# EAGLE design Ultrafin(43)v6_fin (EAGLE 7.4.0)
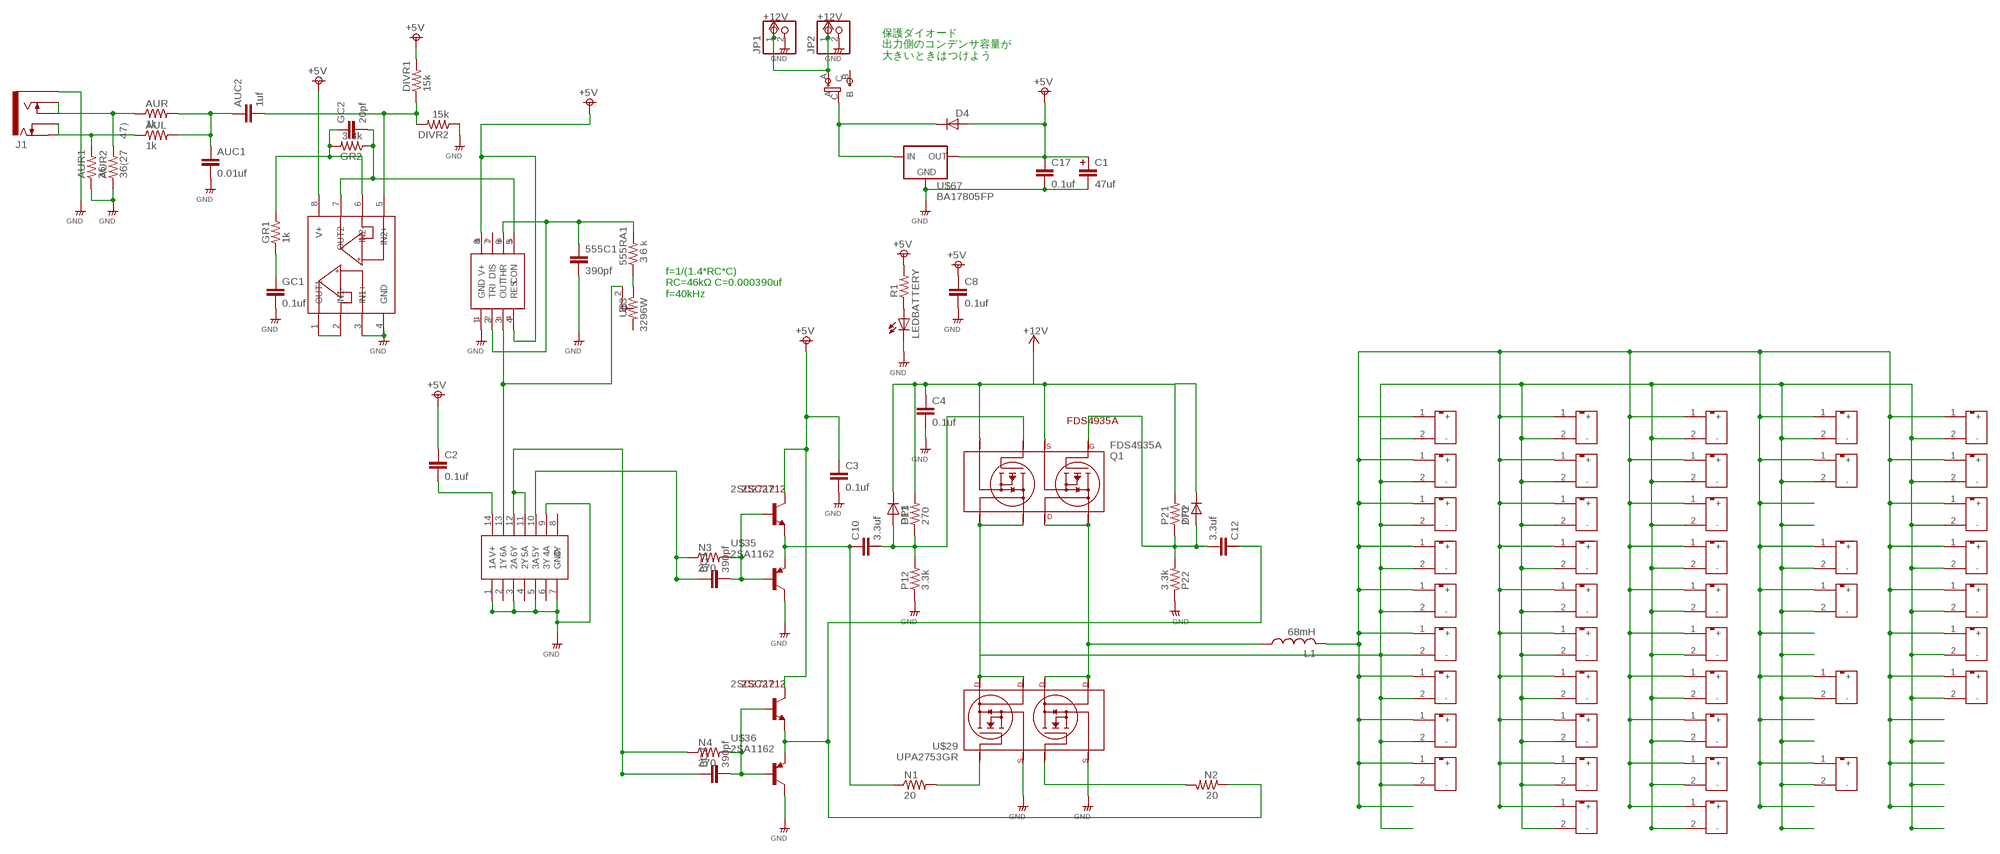
[diagram p0: schematic, sheet 1]

## Parts
555C1  390pf  MLCC  [1608]
555RA1  ３6ｋ  RESISTORS-3  [R_0.3]
AUC1  0.01uf  MLCC  [1608]
AUC2  1uf  MLCC  [1608]
AUL  1k  RESISTORS  [3225]
AUR  1k  RESISTORS  [3225]
AUR1  36  RESISTORS-3  [R_0.3]
AUR2  36(27 47)  RESISTORS1608  [1608]
BC1  390pf  MLCC-3  [MLCC_50]
BC2  390pf  MLCC  [1608]
C1  47uf  CAPACITOR-1U  [C_1U]
C2  0.1uf  MLCC  [1608]
C3  0.1uf  MLCC  [1608]
C4  0.1uf  MLCC  [1608]
C8  0.1uf  MLCC  [1608]
C10  3.3uf  MLCC-3  [MLCC_50]
C12  3.3uf  MLCC-3  [MLCC_50]
C17  0.1uf  MLCC  [1608]
D4  DIODE_JISSO2  [DIODE_JISSO2]
DIVR1  15k  RESISTORS-3  [R_0.3]
DIVR2  15k  RESISTORS-3  [R_0.3]
DP1  DIODE_3  [DIODE_3]
DP2  DIODE_3  [DIODE_3]
GC1  0.1uf  MLCC  [1608]
GC2  20pf  MLCC  [1608]
GR1  1k  RESISTORS  [3225]
GR2  3.3k  RESISTORS-3  [R_0.3]
J1  MJ-352W-C  [MJ-352-M-C]
JP1  PINHD-1X2"  [1*02]
JP2  PINHD-1X2"  [1*02]
L1  68mH  LHL10NB104J  [LHL10NB104J]
LEDBATTERY  LED3MM  [LED3MM]
N1  20  RESISTORS1608  [1608]
N2  20  RESISTORS-3  [R_0.3]
N3  270  RESISTORS1608  [1608]
N4  270  RESISTORS1608  [1608]
P11  270  RESISTORS-3  [R_0.3]
P12  3.3k  RESISTORS-3  [R_0.3]
P21  270  RESISTORS-3  [R_0.3]
P22  3.3k  RESISTORS-3  [R_0.3]
Q1  FDS4935A  [FDS4935A]
R1  RESISTORS3216  [3216]
U$3  3296W  [R_VARIABLE]
U$4  UT1007-Z325R  [UT1007-Z325R]
U$5  ICM7555CD  [SOP8]
U$8  UT1007-Z325R  [UT1007-Z325R]
U$10  UT1007-Z325R  [UT1007-Z325R]
U$11  UT1007-Z325R  [UT1007-Z325R]
U$12  UT1007-Z325R  [UT1007-Z325R]
U$14  74HC04NS  [SOP14]
U$16  BF2904F  [SOP8]
U$18  UT1007-Z325R  [UT1007-Z325R]
U$23  UT1007-Z325R  [UT1007-Z325R]
U$25  UT1007-Z325R  [UT1007-Z325R]
U$27  UT1007-Z325R  [UT1007-Z325R]
U$28  UT1007-Z325R  [UT1007-Z325R]
U$29  UPA2753GR  [UPA2753GR]
U$31  UT1007-Z325R  [UT1007-Z325R]
U$35  2SA1162  [2SA1162]
U$36  2SA1162  [2SA1162]
U$37  2SC2712  [2SC2712]
U$38  2SC2712  [2SC2712]
U$39  UT1007-Z325R  [UT1007-Z325R]
U$40  UT1007-Z325R  [UT1007-Z325R]
U$42  UT1007-Z325R  [UT1007-Z325R]
U$45  UT1007-Z325R  [UT1007-Z325R]
U$46  UT1007-Z325R  [UT1007-Z325R]
U$47  UT1007-Z325R  [UT1007-Z325R]
U$48  UT1007-Z325R  [UT1007-Z325R]
U$49  UT1007-Z325R  [UT1007-Z325R]
U$50  UT1007-Z325R  [UT1007-Z325R]
U$51  UT1007-Z325R  [UT1007-Z325R]
U$52  UT1007-Z325R  [UT1007-Z325R]
U$53  UT1007-Z325R  [UT1007-Z325R]
U$54  UT1007-Z325R  [UT1007-Z325R]
U$55  UT1007-Z325R  [UT1007-Z325R]
U$56  UT1007-Z325R  [UT1007-Z325R]
U$57  UT1007-Z325R  [UT1007-Z325R]
U$58  UT1007-Z325R  [UT1007-Z325R]
U$59  UT1007-Z325R  [UT1007-Z325R]
U$60  UT1007-Z325R  [UT1007-Z325R]
U$61  UT1007-Z325R  [UT1007-Z325R]
U$62  UT1007-Z325R  [UT1007-Z325R]
U$63  UT1007-Z325R  [UT1007-Z325R]
U$64  UT1007-Z325R  [UT1007-Z325R]
U$67  BA17805FP  [BA17805FP]
U$71  UT1007-Z325R  [UT1007-Z325R]
U$74  UT1007-Z325R  [UT1007-Z325R]
U$78  UT1007-Z325R  [UT1007-Z325R]
U$79  UT1007-Z325R  [UT1007-Z325R]
U$80  UT1007-Z325R  [UT1007-Z325R]
U$81  UT1007-Z325R  [UT1007-Z325R]
U$82  UT1007-Z325R  [UT1007-Z325R]
U$83  UT1007-Z325R  [UT1007-Z325R]
U$84  SLIDE_ESD175202  [SLIDE_ESD175202]

## Nets
+5V: C1.P$1 C2.P$1 C3.P$1 C8.P$1 C17.P$1 D4.P$1(A) DIVR1.2 R1.P$6 U$5.4(RES) U$5.8(V+) U$16.8(V+) U$37.C U$38.C U$67.OUTPUT(OUT)
+12V: C4.P$1 DP1.C DP2.C JP1.1 JP2.1 P11.2 P21.2 Q1.1(S2) Q1.3(S1) U$84.A
AGND: 555C1.P$2 AUC1.P$2 AUR1.1 AUR2.P$1 C1.P$2 C8.P$2 C17.P$2 DIVR2.1 GC1.P$2 J1.1 JP1.2 JP2.2 LEDBATTERY.K(C) P12.1 P22.1 U$5.1(GND) U$14.1(1A) U$14.3(2A) U$14.5(3A) U$14.7(GND) U$14.9(4A) U$16.3(IN1+) U$16.4(GND) U$29.1(S1) U$29.3(S2) U$35.C U$36.C U$67.COMMON(GND) ; supply symbol labelled GND
GND: C3.P$2 C4.P$2
N$1: AUR2.P$2 AUR.P$1 J1.2 J1.3
N$2: AUL.P$1 AUR1.2 J1.4 J1.5
N$3: AUC1.P$1 AUC2.P$1 AUL.P$2 AUR.P$2
N$4: C12.1 N2.1 U$36.E U$38.E
N$5: BC2.P$1 N4.P$1 U$14.11(5A) U$14.12(6Y)
N$6: Q1.7(D22) Q1.8(D21) U$4.2(-) U$8.2(-) U$10.2(-) U$11.2(-) U$12.2(-) U$18.2(-) U$23.2(-) U$25.2(-) U$27.2(-) U$28.2(-) U$29.7(D12) U$29.8(D11) U$31.2(-) U$39.2(-) U$40.2(-) U$42.2(-) U$45.2(-) U$46.2(-) U$47.2(-) U$48.2(-) U$49.2(-) U$50.2(-) U$51.2(-) U$52.2(-) U$53.2(-) U$54.2(-) U$55.2(-) U$56.2(-) U$57.2(-) U$58.2(-) U$59.2(-) U$60.2(-) U$61.2(-) U$62.2(-) U$63.2(-) U$64.2(-) U$71.2(-) U$74.2(-) U$78.2(-) U$79.2(-) U$80.2(-) U$81.2(-) U$82.2(-) U$83.2(-)
N$7: 555C1.P$1 555RA1.2 U$5.2(TRI) U$5.6(THR)
N$8: U$3.2 U$5.3(OUT) U$14.13(6A)
N$9: 555RA1.1 U$3.1
N$10: L1.1 Q1.5(D12) Q1.6(D11) U$29.5(D22) U$29.6(D21)
N$11: C10.1 N1.P$1 U$35.E U$37.E
N$12: C10.2 DP1.A P11.1 P12.2 Q1.2(G2)
N$16: BC1.2 N3.P$2 U$35.B U$37.B
N$18: BC2.P$2 N4.P$2 U$36.B U$38.B
N$20: BC1.1 N3.P$1 U$14.10(5Y)
N$21: N1.P$2 U$29.2(G1)
N$22: AUC2.P$2 DIVR1.1 DIVR2.2 U$16.5(IN2+)
N$24: GC2.P$1 GR1.P$2 GR2.2 U$16.6(IN2-)
N$25: GC1.P$1 GR1.P$1
N$26: C12.2 DP2.A P21.1 P22.2 Q1.4(G1)
N$28: N2.2 U$29.4(G2)
N$29: D4.P$2(C) U$67.INPUT(IN) U$84.C
N$30: U$16.1(OUT1) U$16.2(IN1-)
N$39: GC2.P$2 GR2.1 U$5.5(CON) U$16.7(OUT2)
N$40: LEDBATTERY.A R1.P$5
N$41: L1.2 U$4.1(+) U$8.1(+) U$10.1(+) U$11.1(+) U$12.1(+) U$18.1(+) U$23.1(+) U$25.1(+) U$27.1(+) U$28.1(+) U$31.1(+) U$39.1(+) U$40.1(+) U$42.1(+) U$45.1(+) U$46.1(+) U$47.1(+) U$48.1(+) U$49.1(+) U$50.1(+) U$51.1(+) U$52.1(+) U$53.1(+) U$54.1(+) U$55.1(+) U$56.1(+) U$57.1(+) U$58.1(+) U$59.1(+) U$60.1(+) U$61.1(+) U$62.1(+) U$63.1(+) U$64.1(+) U$71.1(+) U$74.1(+) U$78.1(+) U$79.1(+) U$80.1(+) U$81.1(+) U$82.1(+) U$83.1(+)
N$43: C2.P$2 U$14.14(V+)
Unconnected: U$3.3 U$5.7(DIS) U$14.2(1Y) U$14.4(2Y) U$14.6(3Y) U$14.8(4Y) U$84.B

## Notes on the sheet
- 保護ダイオード
  出力側のコンデンサ容量が
  大きいときはつけよう
- f=1/(1.4*RC*C)
  RC=46kΩ C=0.000390uf
  f=40kHz

## Library data of the parts
555C1 AUC1 AUC2 BC1 BC2 C2-C4 C8 C10 C12 C17 GC1 GC2 = rcl__s:MLCC: CAPACITOR, European symbol
555RA1 AUL AUR AUR1 AUR2 DIVR1 DIVR2 GR1 GR2 N1-N4 P11 P12 P21 P22 R1 = rcl__s:RESISTORS
C1 = rcl__s:CAPACITOR
D4 DP1 DP2 = diode_s:DIODE
J1 = demi:MJ-352W-C: MJ-352W-C Marushin 3.5mm Stereo Jack
JP1 JP2 = pinhead_s:PINHD-1X2: PIN HEADER
L1 = Coil:LHL10NB104J
LEDBATTERY = LED_s:LED: LED OSRAM: - CHIPLED LG R971, LG N971, LY N971, LG Q971, LY Q971, LO R971, LY R971 LH N974, LH R974 LS Q976, LO Q976, LY Q976 LO Q996 - Hyper CHIPLED LW Q18S LB Q993, LB Q99A, LB R99A - SideLED LS A670, LO A670, LY A670, LG A670, LP A670 LB A673, LV A673, LT A673, LW A673 LH A674 LY A675 LS A676, LA A676, LO A676, LY A676, LW A676 LS A679, LY A679, LG A679 - Hyper Micro SIDELED® LS Y876, LA Y876, LO Y876, LY Y876 LT Y87S - SmartLED LW L88C, LW L88S LB L89C, LB L89S, LG L890 LS L89K, LO L89K, LY L89K LS L896, LA L896, LO L896, LY L896 - TOPLED LS T670, LO T670, LY T670, LG T670, LP T670 LSG T670, LSP T670, LSY T670, LOP T670, LYG T670 LG T671, LOG T671, LSG T671 LB T673, LV T673, LT T673, LW T673 LH T674 LS T676, LA T676, LO T676, LY T676, LB T676, LH T676, LSB T676, LW T676 LB T67C, LV T67C, LT T67C, LS T67K, LO T67K, LY T67K, LW E67C LS E67B, LA E67B, LO E67B, LY E67B, LB E67C, LV E67C, LT E67C LW T67C LS T679, LY T679, LG T679 LS T770, LO T770, LY T770, LG T770, LP T770 LB T773, LV T773, LT T773, LW T773 LH T774 LS E675, LA E675, LY E675, LS T675 LS T776, LA T776, LO T776, LY T776, LB T776 LHGB T686 LT T68C, LB T68C - Hyper Mini TOPLED® LB M676 - Mini TOPLED Santana® LG M470 LS M47K, LO M47K, LY M47K Source: http://www.osram.convergy.de - LUMILED® LXK2-PW12-R00, LXK2-PW12-S00, LXK2-PW14-U00, LXK2-PW14-V00 LXK2-PM12-R00, LXK2-PM12-S00, LXK2-PM14-U00 LXK2-PE12-Q00, LXK2-PE12-R00, LXK2-PE12-S00, LXK2-PE14-T00, LXK2-PE14-U00 LXK2-PB12-K00, LXK2-PB12-L00, LXK2-PB12-M00, LXK2-PB14-N00, LXK2-PB14-P00, LXK2-PB14-Q00 LXK2-PR12-L00, LXK2-PR12-M00, LXK2-PR14-Q00, LXK2-PR14-R00 LXK2-PD12-Q00, LXK2-PD12-R00, LXK2-PD12-S00 LXK2-PH12-R00, LXK2-PH12-S00 LXK2-PL12-P00, LXK2-PL12-Q00, LXK2-PL12-R00 Source: www.luxeon.com
Q1 = FET_s:FDS4935A
U$3 = rcl__s:3296W
U$4 U$8 U$10-U$12 U$18 U$23 U$25 U$27 U$28 U$31 U$39 U$40 U$42 U$45-U$64 U$71 U$74 U$78-U$83 = UT1007-Z325R:UT1007-Z325R
U$5 = LMC555:ICM7555CD
U$14 = 74HCserias:74HC04NS
U$16 = OP_s:BF2904F
U$29 = FET_s:UPA2753GR
U$35 U$36 = demi:2SA1162
U$37 U$38 = demi:2SC2712
U$67 = regulator_s:BA17805FP
U$84 = switch_s:SLIDE_ESD175202

## Board
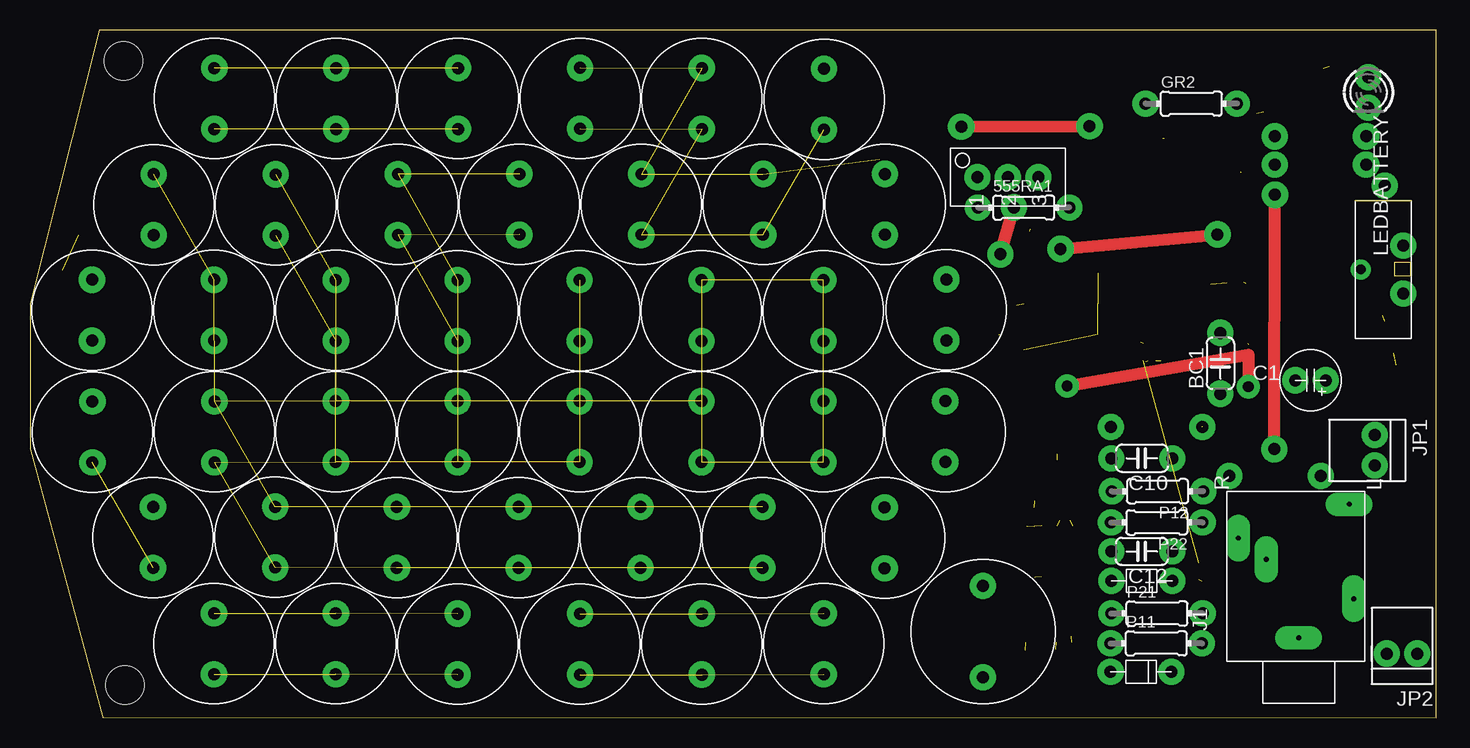
[diagram p1: board, top side]
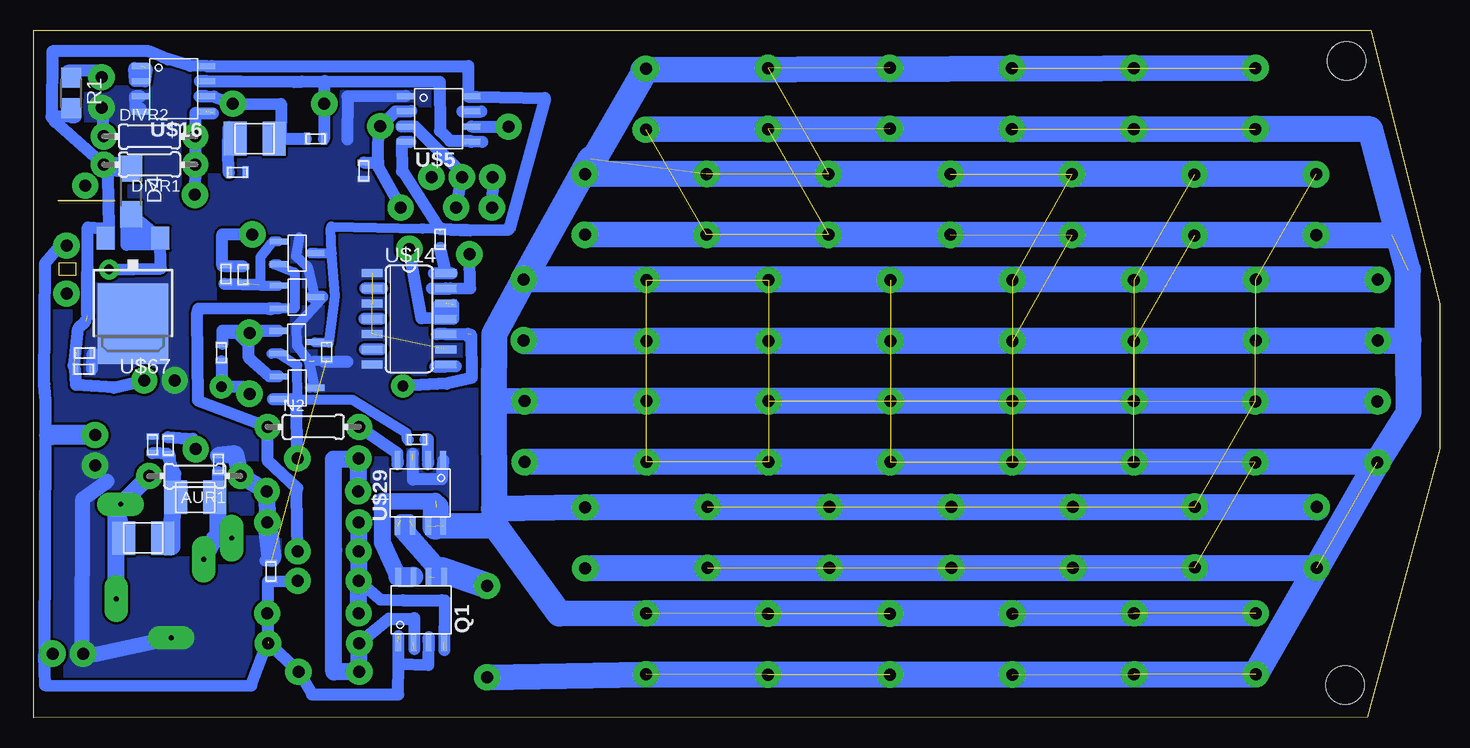
[diagram p2: board, bottom side, seen from below]

Size 117.24 x 57.36 mm. Coordinates in mm from the lower left corner, seen from the top.
Outline: 117.24,57.33 5.76,57.36 0,34.53 0.02,22.42 6.06,0.05 117.24,0 117.24,57.33
Copper layers (1*16): Top 0.035mm / dielectric 1.5mm / Bottom 0.035mm
Design rules "default": minimum track width 10mil, minimum drill 24mil, track to track 8mil, track to pad 8mil, pad to pad 8mil, via to via 8mil, smd to smd 8mil, copper to edge 40mil, drill to drill 8mil, minimum pad ring 10mil, minimum via ring 8mil, stop-mask expansion 4mil, vias tented up to drill 0mil, thermal gap 10mil
Holes 3.2 mm at 7.78,54.79 7.91,2.75

### Footprints (pad centres in the part's own frame; a part is rotated, then mirrored left to right if it is on the bottom)
1608 = smd 0.5 x 1: P$1 -0.7,0; P$2 0.7,0
R_0.3 = drill 1 pad 2.184: 1 -3.81,0; 2 3.81,0; 3 -3.81,0
3225 = smd 1.9 x 2.8: P$1 -1.27,0.02; P$2 1.98,0.02
MLCC_50 = drill 1 pad 2.184: 1 -2.54,0; 2 2.54,0
C_1U = drill 1 pad 2.184: P$1 -1.27,0; P$2 1.27,0
DIODE_JISSO2 = smd 2.184 x 1.829: P$1 -1.905,0; P$2 1.905,0
DIODE_3 = drill 1 pad 2.184: A -2.54,0; C 2.54,0
MJ-352-M-C = drill 0.4 pad 1.95 long: 1 -4.655,-1.99; 2 3.645,3.05; 3 1.875,0.72; 4 6.475,-6.2; 5 -1.405,-6.58
1*02 = drill 1 pad 2.184: 1 -1.27,0; 2 1.27,0
LHL10NB104J = drill 1 pad 2.184: 1 0,3.81; 2 0,-3.81
LED3MM = drill 1 pad 2.184: A -1.27,0; K 1.27,0
FDS4935A = smd 1.5 x 0.5: 1 -2.74,1.905; 2 -2.74,0.635; 3 -2.74,-0.635; 4 -2.74,-1.905; 5 2.74,-1.905; 6 2.74,-0.635; 7 2.74,0.635; 8 2.74,1.905
3216 = smd 1.676 x 1.676: P$5 0,0; P$6 2.54,0
R_VARIABLE = drill 1 pad 2.184: 1 0.019,-2.578; 2 0.019,-0.037; 3 0.019,2.502
UT1007-Z325R = drill 1 pad 2.184: 1 0,2.54; 2 0,-2.54
SOP8 = smd 1.5 x 0.5: 1 -2.74,1.905; 2 -2.74,0.635; 3 -2.74,-0.635; 4 -2.74,-1.905; 5 2.74,-1.905; 6 2.74,-0.635; 7 2.74,0.635; 8 2.74,1.905
SOP14 = smd 0.66 x 1.778: 1 -3.81,-3.073; 2 -2.54,-3.073; 3 -1.27,-3.073; 4 0,-3.073; 5 1.27,-3.073; 6 2.54,-3.073; 7 3.81,-3.073; 8 3.81,3.073; 9 2.54,3.073; 10 1.27,3.073; 11 0,3.073; 12 -1.27,3.073; 13 -2.54,3.073; 14 -3.81,3.073
UPA2753GR = smd 1.5 x 0.5: 1 -2.74,1.905; 2 -2.74,0.635; 3 -2.74,-0.635; 4 -2.74,-1.905; 5 2.74,-1.905; 6 2.74,-0.635; 7 2.74,0.635; 8 2.74,1.905
2SA1162 = smd 1.524 x 0.508: B -1.459,0.767; C 1.594,-0.182; E -1.459,-1.133
2SC2712 = smd 1.524 x 0.508: B -1.696,0.95; C 1.356,0; E -1.696,-0.95
BA17805FP = smd 5.908 x 6.708: COMMON 0,1.547 | smd 1.508 x 1.93: INPUT -2.28,-5.594; OUTPUT 2.28,-5.594
SLIDE_ESD175202 = drill 1 pad 2.184: A -0.031,-7.735; B -0.031,-3.735; S2 1.531,-12.735 | drill 0.8 pad 1.676: C 3.519,-5.747

### Placement (x,y rotation side)
555C1  89.71,45.61 270 bottom
555RA1  82.84,42.55 0 top
AUC1  107.31,22.78 90 bottom
AUC2  106.01,22.7 90 bottom
AUL  108.46,14.97 0 bottom
AUR  103.41,18.42 180 bottom
AUR1  103.79,20.16 180 bottom
AUR2  101.84,21.16 270 bottom
BC1  99.23,29.56 90 top
BC2  99.77,36.94 270 bottom
C1  106.74,28.15 180 top
C2  83.34,39.9 270 bottom
C3  92.81,30.5 270 bottom
C4  97.44,12.21 90 bottom
C8  113.06,29.07 0 bottom
C10  92.69,21.64 180 top
C12  92.68,13.88 180 top
C17  113,30.42 0 bottom
D4  109.09,43.9 270 bottom
DIVR1  107.57,46.14 180 bottom
DIVR2  107.57,48.49 0 bottom
DP1  92.61,3.83 0 top
DP2  92.68,11.43 0 top
GC1  100.23,45.49 0 bottom
GC2  93.73,48.28 0 bottom
GR1  99.16,48.28 0 bottom
GR2  96.81,51.22 0 top
J1  103.77,11.34 90 top
JP1  112.11,22.31 270 top
JP2  114.38,5.35 180 top
L1  79.44,7.19 0 top
LEDBATTERY  111.57,52.15 270 top
N1  85.26,23.21 0 bottom
N2  93.92,24.26 0 bottom
N3  101.57,30.44 90 bottom
N4  101.19,37.01 270 bottom
P11  93.88,6.21 0 top
P12  94,18.89 180 top
P21  93.95,8.7 0 top
P22  93.93,16.29 180 top
Q1  84.93,9.02 90 bottom
R1  114.09,53.38 270 bottom
U$3  81.57,45.1 270 top
U$4  25.5,23.86 180 top
U$5  83.47,49.95 0 bottom
U$8  15.34,6.18 180 top
U$10  25.5,6.18 180 top
U$11  35.66,6.15 180 top
U$12  45.85,6.15 180 top
U$14  85.93,33.26 270 bottom
U$16  105.57,52.45 0 bottom
U$18  56.01,6.15 180 top
U$23  66.17,6.18 180 top
U$25  30.58,15.04 180 top
U$27  25.5,33.98 180 top
U$28  30.67,42.8 180 top
U$29  84.99,18.75 270 bottom
U$31  45.86,51.66 180 top
U$35  95.35,27.71 0 bottom
U$36  95.35,35.28 0 bottom
U$37  95.12,31.32 0 bottom
U$38  95.11,38.77 0 bottom
U$39  20.43,15.07 180 top
U$40  56.01,51.64 180 top
U$42  71.25,15.01 180 top
U$45  20.48,42.77 180 top
U$46  35.69,51.64 180 top
U$47  25.53,51.64 180 top
U$48  15.37,51.64 180 top
U$49  15.34,33.99 180 top
U$50  40.8,42.82 180 top
U$51  50.96,42.82 180 top
U$52  61.12,42.82 180 top
U$53  71.28,42.82 180 top
U$54  76.39,34.02 180 top
U$55  55.98,23.86 180 top
U$56  45.82,23.86 180 top
U$57  35.66,23.86 180 top
U$58  66.14,33.96 180 top
U$59  76.3,23.86 180 top
U$60  66.14,23.86 180 top
U$61  55.98,33.96 180 top
U$62  45.82,33.96 180 top
U$63  35.66,33.96 180 top
U$64  40.74,15.04 180 top
U$67  108.95,34.4 180 bottom
U$71  15.38,23.85 180 top
U$74  66.2,51.58 180 top
U$78  50.9,15.04 180 top
U$79  61.06,15.04 180 top
U$80  10.26,15.04 180 top
U$81  5.18,33.99 180 top
U$82  10.32,42.79 180 top
U$83  5.21,23.83 180 top
U$84  114.46,31.64 180 top

### Tracks (layer width: path | path; a pad name or v marks a point on that pad's centre or on a via)
+5V  (4 unrouted)
  Bottom 0.813: U$37.C 92.61,31.29 92.11,35.17 92.38,38.73 | U$38.C 94.11,38.77 94.11,38.75 92.38,38.73 | 92.38,38.73 93.52,38.72 92.39,38.78 92.49,40.75 92.42,40.85 92.42,40.98 84.87,40.82 84.84,40.81 84.73,40.81 83.71,40.84
  Bottom 1.016: 112.74,33.55 112.71,40.91 110.93,40.79 | 83.71,40.84 81.04,40.65 | 81.04,40.65 82.19,40.68 77.6,40.72 74.61,51.68 80.28,51.79 81.02,51.81 | U$5.8 81.02,51.81 | 81.02,51.81 80.99,54.34 102.36,54.34 U$16.8 104.14,54.38 106.43,55.07 | 106.43,55.07 106.04,54.91 | U$5.4 85.82,48.01 86.2,48.02 86.55,48.02 86.55,47.99 86.52,45.56 86.49,45.58 83.38,40.77 80.8,40.65 81.04,40.65 | 106.43,55.07 107.6,55.58 115.67,55.58 115.73,50.18 | 111.36,46.2 DIVR1.2 | 115.73,50.18 115.76,50.09 115.44,49.71 DIVR1.2 | R1.P$6 114.14,50.09 113.73,50.09 115.73,50.18 | 112.9,33.1 113.51,32.5 113.86,29.35 113.89,29.42 113.86,29.26 C8.P$1 113.7,27.77 110.52,27.55 C1.P$1 | U$67.OUTPUT 110.93,40 110.93,40.79 | 110.93,40.79 111.03,45.2 DIVR1.2 | 111.09,45.99 DIVR1.2
  Bottom 1.676: D4.P$1 111.09,45.99
+12V  (3 unrouted)
  Bottom 1.016: 114.49,39.26 U$84.A 115.03,39.38 116.29,37.87 116.3,37.87 116.27,37.83 116.33,27.86 | 86.82,4.47 86.84,1.96 94.01,1.96 DP1.C 97.66,6.34 97.66,6.37 97.82,6.11 99.09,2.72 99.09,2.69 116.27,2.72 116.36,5.23 | 86.82,4.47 86.8,6.81 | Q1.3 84.3,6.75 84.33,4.4 86.82,4.47 | 116.28,23.59 116.27,26.75 116.33,27.86 | 116.28,23.59 116.36,5.23 | DP2.C 97.69,11.37 P11.2 97.69,8.21 97.76,8.27 P21.2 | 116.3,27.23 116.33,27.86 | 116.36,5.23 JP2.1 | JP1.1 116.28,23.59
AGND  (6 unrouted)
  Bottom 0.813: 94.2,27.55 U$35.C 94.27,29.77 95.28,31.04 95.31,32.69 93.22,34.98 U$36.C 94.36,37.58 95.34,38.5 95.06,40.06 | 93.19,29.77 93.85,29.77
  Bottom 1.016: U$5.1 91.06,51.8 91.07,48.22 | LEDBATTERY.K DIVR2.1 | C8.P$2 C17.P$2 | U$16.3 108.78,51.82 108.78,51.55 108.74,51.55 108.74,50.82 108.31,50.82 U$16.4 | 91.09,29.67 93.03,29.67 | 97.44,14.5 97.41,14.5 97.41,13.42 97.41,13.1 97.92,13.1 | U$29.1 83.22,19.89 85.6,19.86 85.63,22.02
  Bottom 1.27: J1.1 112.11,5.29 113.19,5.35 113.13,18.28 111.09,19.72
  Bottom 1.422: P22.1 P12.1 AUR1.1 100.39,21.99 100.58,22.02 AUR2.P$1
  Bottom 1.676: P22.1 97.41,13.42
  pour Bottom (rank 6, no thermals): 116.94,0.91 116.74,56.6 6.6,56.6 0.76,33.29 0.76,23.13 6.73,0.72
GND  (1 unrouted)
N$1
  Bottom 1.016: AUR2.P$2 101.92,19.42 101.92,19.39 AUR.P$1
  Bottom 1.27: J1.2 101.92,14.94
  Bottom 1.422: AUR.P$1 101.89,17.61 101.89,14.97 102.14,14.97 | 102.14,14.97 J1.2 | J1.3 102.14,14.97
N$2
  Bottom 1.422: J1.5 110.36,17.45 | 110.36,17.45 J1.4 AUR1.2 | 110.36,17.45 AUL.P$1
N$3
  Bottom 1.016: 105.38,19.07 105.41,20.37 105.98,21.64 AUC2.P$1 AUC1.P$1
  Bottom 1.422: AUL.P$2 106.3,14.27 105.7,14.27 105.63,19.04 105.09,19.07 105.38,19.07 105.38,18.37 AUR.P$2
N$4  (1 unrouted)
  Bottom 0.813: U$38.E 96.81,37.8 97.22,37.8 97.22,37.83 95.47,37.13 95.47,34.15 U$36.E
  Bottom 1.016: C12.1 95.31,18.69 95.25,19.13 97.71,21.42 N2.1 | U$36.E 97.69,34.12 97.47,34.09 103.51,34.11 103.63,33.58 103.54,26.47 97.69,24.28
N$5  (via drill 1 pad 2.18)  (1 unrouted)
  Top 1.016: v85.92,39.1 v99,40.31
  Bottom 1.016: U$14.11 83.69,33.29 | 83.69,33.29 82.23,33.26 82.23,34.44 | 83.69,33.29 84.9,33.32 v85.92,39.1 | v99,40.31 101.5,40.31 101.5,37.71 N4.P$1 101.19,37.64 BC2.P$1
N$6  (33 unrouted)
  Bottom 1.422: Q1.8 88.14,14.59 88.14,18.05 83.72,18.08
  Bottom 1.676: Q1.8 Q1.7
  Bottom 2.184: U$48.2 66.39,53.99 U$74.2 U$53.2 | U$54.2 70.8,46.6 U$53.2 | U$54.2 78.84,31.99 78.87,26.37 | 78.87,26.37 U$59.2 5.21,26.4 U$83.2 | 78.87,26.37 78.87,17.42 | 78.87,17.42 78.71,15.99 | 78.71,15.99 83.72,15.96 83.69,17.55 | 78.87,17.42 U$42.2 10.25,17.55 U$80.2 | 78.71,15.99 73.41,8.69 U$23.2 U$8.2 | U$81.2 5.18,36.56 U$54.2 | U$82.2 10.32,45.36 U$53.2
N$7  (via drill 1 pad 2.18)
  Top 1.016: v77.63,49.29 v88.33,49.33
  Bottom 1.016: 555RA1.2 86.61,42.48 88.47,45.9 88.49,46.4 | U$5.6 v77.63,49.29 | U$5.2 85.76,50.63 85.82,50.57 87.09,50.57 v88.33,49.33 88.49,49.07 88.52,47.1 88.49,46.4 | 555C1.P$1 88.49,46.31 88.49,46.4
N$8  (via drill 1 pad 2.18)
  Top 1.016: v80.9,38.66 v82.01,42.56
  Bottom 1.016: U$14.13 80.84,35.83 v80.9,38.66 | v82.01,42.56 U$3.2 81.53,45.38 85.45,49.31 86.57,49.31 86.58,49.33 U$5.3
N$9
  Bottom 1.016: U$3.1 555RA1.1
N$10  (3 unrouted)
  Bottom 1.016: 85.95,16.47 86.68,16.47 86.68,15.45 86.29,15.59 85.85,15.39 85.85,16.47 86.36,16.02
  Bottom 1.422: 83.6,12.5 83.79,11.7 Q1.5
  Bottom 1.676: 83.6,12.5 86.29,15.59
  Bottom 1.93: 80.99,11.45 83.2,12.31 83.6,12.5
  Bottom 2.184: L1.1 83.2,12.31
N$11
  Bottom 0.813: U$35.E 95.22,26.53 | U$37.E 95.25,29.39 95.22,26.53 | N1.P$1 86.07,23.14 86.17,23.77 90.7,26.53 92.58,26.54 95.22,26.53
  Bottom 1.016: C10.1 95.2,21.6 95.34,26.56 97.28,26.56 97.28,26.57 U$35.E
N$12  (1 unrouted)
  Bottom 0.406: 90.15,21.58 C10.2 90.19,21.64
  Bottom 1.016: DP1.A 89.98,3.83 | P11.1 87.6,8.27 85.6,8.27 85.5,8.31 85.5,5.73 | 92.2,13.99 92.23,13.99
  Bottom 1.422: 92.2,13.99 92.2,3.83 DP1.A P11.1 | 92.23,13.99 92.23,21.58 90.15,21.58 | 90.19,21.64 P12.2
N$15
  Bottom 1.016: 105.85,19.39 105.85,21.83
N$16  (1 unrouted)
  Bottom 1.016: U$35.B 97.57,28.47 99.28,30.02 99.28,31.13 | 99.28,31.13 99.28,32.05 BC1.2 | U$37.B 101.5,32.27 101.5,32.1 | 99.28,31.13 100.25,32.1 101.5,32.1 | 101.5,32.1 101.5,31.2
N$17
  Bottom 1.016: 83.53,34.37 82.39,34.37 82.36,34.34 82.68,34.34 83.18,33.83 83.5,33.83 83.53,33.8
N$18  (2 unrouted)
  Bottom 0.813: 98.45,36.15 98.36,36.06 | U$38.B 97.27,39.72 97.41,39.58 98.33,38.4 98.36,36.06 | 98.36,36.06 U$36.B
  Bottom 1.016: 101.34,36.21 98.45,36.15
N$19
  Bottom 1.016: 83.88,37.07 82.36,37.07
N$20  (via drill 0.9 pad 1.93)  (1 unrouted)
  Top 1.016: v86.46,27.67 101.57,30.28 v101.57,27.61
  Bottom 1.016: 83.63,31.99 U$14.10 81.03,32.02 | 80.87,31.64 80.77,31.96 80.71,28.34 82.77,27.86 v86.46,27.67 | v101.57,27.61 99.82,27.61 BC1.1 | 101.5,27.67 v101.57,27.61 | N3.P$1 v101.57,27.61
N$21
  Bottom 1.016: 84.36,21.13 U$29.2 84.36,23.07 84.38,23.23 N1.P$2
N$22  (via drill 1 pad 2.18)  (1 unrouted)
  Top 1.016: v103.73,22.4 v103.79,43.61
  Bottom 1.016: 103.82,22.34 v103.73,22.4 103.95,23.26 AUC2.P$2 | 102.27,50.41 103.73,50.44 DIVR2.2 DIVR1.1 v103.79,43.61
N$24  (1 unrouted)
  Bottom 1.016: U$16.6 103.41,51.84 102.2,51.8 GR2.2 96.74,51.17 96.62,51.2 96.65,47.9 GR1.P$2 94.55,48.28
N$25  (1 unrouted)
  Bottom 1.016: 100.97,45.45 101,47.29 100.96,49.29 GR1.P$1
N$26  (1 unrouted)
  Bottom 1.016: 82.99,5.64 82.96,9.77 83.18,9.8 86.46,9.8 88.33,9.86 DP2.A | P22.2 90.14,16.29 C12.2
  Bottom 1.422: P22.2 DP2.A P21.1
N$28
  Bottom 1.016: 86.9,21.13 U$29.4 86.9,22.05 N2.2
N$29
  Bottom 1.016: U$67.INPUT 108.67,40.93 | U$84.C 106.62,37.48 U$67.INPUT | D4.P$2 U$67.INPUT
  Bottom 1.27: 108.9,42.22 D4.P$2
N$30  (1 unrouted)
  Bottom 1.016: U$16.2 108.78,53.11 108.84,54.18 107.82,54.15 107.95,53.07
N$31
  Bottom 1.016: 84.04,35.8 82.49,35.8
N$32
  Bottom 0.813: 96.57,30.36 96.57,30.37 97.41,30.37
N$33
  Bottom 1.016: 83.72,29.26 82.04,29.32
N$34
  Bottom 1.016: 93.14,35.1 94.09,35.1
N$35
  Bottom 1.016: 88.26,30.72 89.63,30.72
N$37
  Bottom 1.016: 88.26,33.26 89.66,33.26
N$38
  Bottom 1.016: 88.14,35.8 89.57,35.8
N$39
  Bottom 1.016: U$16.7 103.35,53.09 103.35,53.07 99.98,53.07 94.87,53.06 | 94.87,53.06 92.96,53.09 | 92.96,53.09 83.38,53.04 83.35,48.96 82.52,48.12 80.81,48.12 U$5.5 79.82,48.02 | 95.54,53.01 94.87,53.06 | 92.96,53.09 GR2.1 GC2.P$2
N$40
  Bottom 1.016: LEDBATTERY.A 111.66,53.96 114.39,53.96 R1.P$5
N$41  (29 unrouted)
  Bottom 2.184: L1.2 U$23.1 U$8.1 U$83.1 | U$83.1 2.6,25.48 2.63,31.51 U$81.1 | U$81.1 2.67,31.45 2.67,37.33 5.81,49.07 U$48.1 U$74.1 | U$53.1 U$82.1 4,40.25 | U$81.1 U$49.1 25.5,31.45 U$27.1 25.5,31.42 U$58.1 76.33,31.42 U$54.1 | U$42.1 71.25,12.5 U$80.1 | U$83.1 5.21,21.32 U$59.1
N$42
  Bottom 1.016: 81.5,50.57 79.91,50.57
N$43
  Bottom 1.016: U$14.14 C2.P$2
N$44
  Bottom 1.016: 106.71,39.45 109.47,39.45 109.47,40.88 109.16,40.88 108.04,39.77 108.55,39.77 108.74,39.96
N$46
  Bottom 1.676: 112.01,23.58 115.76,23.58 115.79,23.61
N$47
  Bottom 1.676: 115.54,5.42 115.82,5.42 115.86,5.38